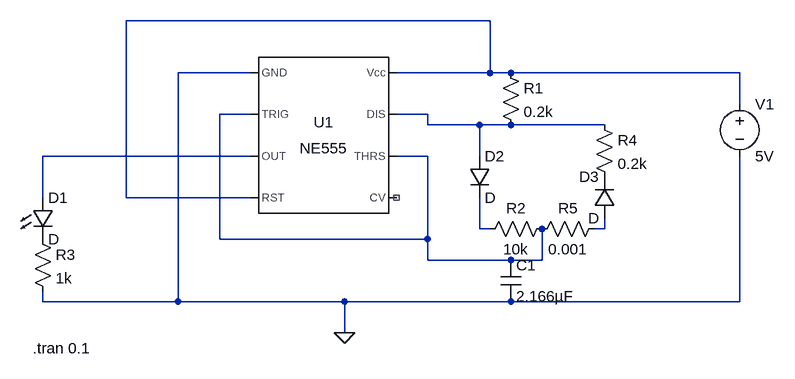
[diagram p0: schematic Draft2.asc]
Draft2.asc, the LTspice schematic file:
Version 4
SHEET 1 1016 680
WIRE 576 -80 16 -80
WIRE 208 0 96 0
WIRE 576 0 576 -80
WIRE 576 0 432 0
WIRE 608 0 576 0
WIRE 960 0 608 0
WIRE 960 48 960 0
WIRE 208 64 160 64
WIRE 480 64 432 64
WIRE 480 80 480 64
WIRE 560 80 480 80
WIRE 608 80 560 80
WIRE 752 80 608 80
WIRE 208 128 -112 128
WIRE 480 128 432 128
WIRE 560 128 560 80
WIRE -112 192 -112 128
WIRE 16 192 16 -80
WIRE 208 192 16 192
WIRE 560 240 560 192
WIRE 576 240 560 240
WIRE 752 240 752 224
WIRE 752 240 736 240
WIRE 160 256 160 64
WIRE 480 256 480 128
WIRE 480 256 160 256
WIRE 480 288 480 256
WIRE 608 288 480 288
WIRE 656 288 656 240
WIRE 656 288 608 288
WIRE -112 352 -112 336
WIRE 96 352 96 0
WIRE 96 352 -112 352
WIRE 352 352 96 352
WIRE 608 352 352 352
WIRE 960 352 960 128
WIRE 960 352 608 352
WIRE 352 400 352 352
FLAG 352 400 0
SYMBOL Misc\\NE555 320 96 R0
SYMATTR InstName U1
SYMBOL voltage 960 32 R0
WINDOW 123 0 0 Left 0
WINDOW 39 0 0 Left 0
SYMATTR InstName V1
SYMATTR Value 5V
SYMBOL res 592 -16 R0
SYMATTR InstName R1
SYMATTR Value 0.2k
SYMBOL cap 592 288 R0
SYMATTR InstName C1
SYMATTR Value 2.166µF
SYMBOL LED -128 192 R0
SYMATTR InstName D1
SYMBOL res -128 240 R0
SYMATTR InstName R3
SYMATTR Value 1k
SYMBOL diode 544 128 R0
SYMATTR InstName D2
SYMBOL res 560 256 R270
WINDOW 0 32 56 VTop 2
WINDOW 3 0 56 VBottom 2
SYMATTR InstName R2
SYMATTR Value 10k
SYMBOL res 736 64 R0
SYMATTR InstName R4
SYMATTR Value 0.2k
SYMBOL res 752 224 R90
WINDOW 0 0 56 VBottom 2
WINDOW 3 32 56 VTop 2
SYMATTR InstName R5
SYMATTR Value 0.001
SYMBOL diode 768 224 R180
WINDOW 0 24 64 Left 2
WINDOW 3 24 0 Left 2
SYMATTR InstName D3
TEXT -128 424 Left 2 !.tran 0.1

The netlist it stands for:
* Draft2.asc
XU1 0 N002 N004 N001 NC_01 N002 N003 N001 NE555  ; pins GND TRIG OUT RST CV THRS DIS Vcc
V1 N001 0 5V
R1 N001 N003 0.2k
C1 N002 0 2.166µF
D1 N004 P001 D
R3 P001 0 1k
D2 N003 N005 D
R2 N005 N002 10k
R4 N003 P002 0.2k
R5 N006 N002 0.001
D3 N006 P002 D
.model D D
.lib standard.dio
.tran 0.1
.lib NE555.sub
.backanno
.end